# Altium project SyringeDriverHW10.PrjPcb
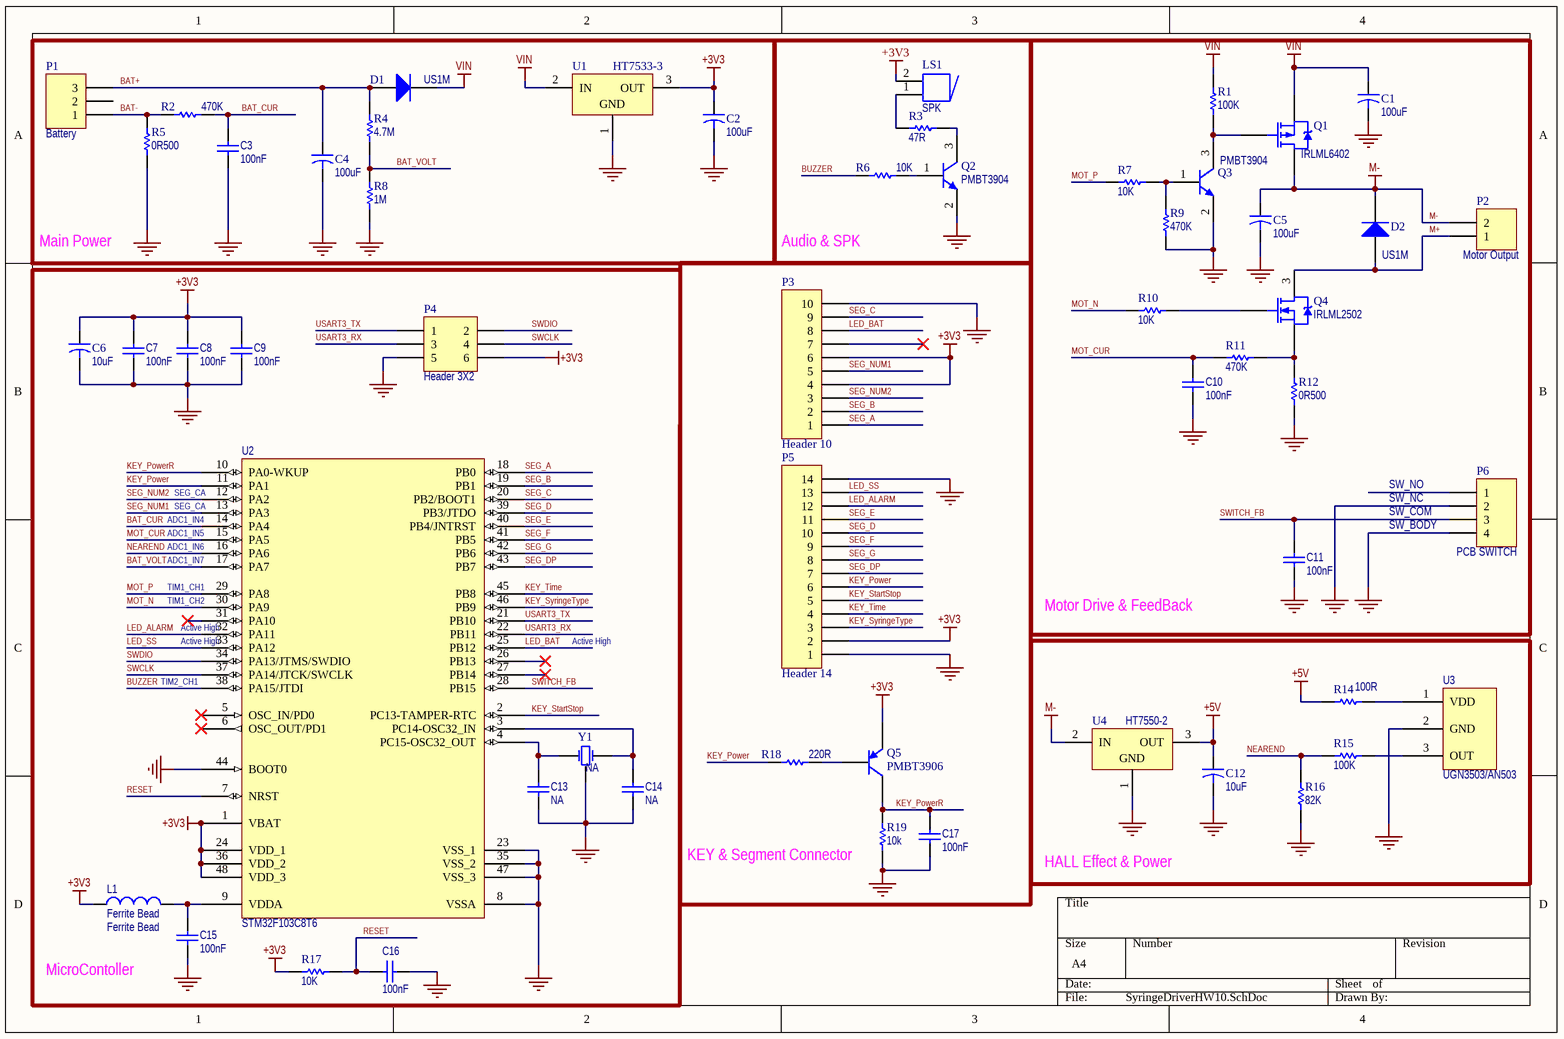
[diagram p0: SyringeDriverHW10.SchDoc]
1 sheet, 55 parts. Net scope: global (net labels, ports and power ports of the same name join across sheets).
Board file: SyringeDriverHW10.PcbDoc

## Sheet SyringeDriverHW10.SchDoc
size A4

### Parts
C1  100uF  [CAP_EL_SMD_6.3x5.4]
C2  100uF  [CAP_EL_SMD_6.3x5.4]
C3  100nF  [CAP0805]
C4  100uF  [CAP_EL_SMD_6.3x5.4]
C5  100uF  [CAP_EL_SMD_6.3x5.4]
C6  10uF  [CAP_TANTAL_TYPE_A]
C7  100nF  [CAP0805]
C8  100nF  [CAP0805]
C9  100nF  [CAP0805]
C10  100nF  [CAP0805]
C11  100nF  [CAP0805]
C12  10uF  [CAP_EL_SMD_4x5.3]
C13  NA  [CAP0805]
C14  NA  [CAP0805]
C15  100nF  [CAP0805]
C16  100nF  [CAP0805]
C17  100nF  [CAP0805]
D1  US1M  [DO-241AC]
D2  US1M  [DO-241AC]
L1  Ferrite Bead  [IND0805]
LS1  SPK  [XH-2PIN]
P1  Battery  [XH-3PIN]
P2  Motor Output  [XH-2PIN]
P3  Header 10  [HDR_1x10-2mm]
P4  Header 3X2  [HDR2X3]
P5  Header 14  [HDR_1x14-2mm]
P6  PCB SWITCH  [MICROSW_VERTICAL]
Q1  IRLML6402  [Micro3_N]
Q2  PMBT3904  [SOT23_N]
Q3  PMBT3904  [SOT23_N]
Q4  IRLML2502  [SOT-23_N]
Q5  PMBT3906  [SOT23_N]
R1  100K  [RES0805]
R2  470K  [RES0805]
R3  47R  [RES0805]
R4  4.7M  [RES0805]
R5  0R500  [RES2512]
R6  10K  [RES0805]
R7  10K  [RES0805]
R8  1M  [RES0805]
R9  470K  [RES0805]
R10  10K  [RES0805]
R11  470K  [RES0805]
R12  0R500  [RES2512]
R14  100R  [RES0805]
R15  100K  [RES0805]
R16  82K  [RES0805]
R17  10K  [RES0805]
R18  220R  [RES0805]
R19  10k  [RES0805]
U1  HT7533-3  [SOT89N]
U2  STM32F103C8T6  [LQFP48_N]
U3  UGN3503/AN503  [TO-92 BENT]
U4  HT7550-2  [SOT89N]
Y1  NA  [Crystal_NC308-RA]

### Nets
+3V3: C2.1 C6.1 C7.2 C8.2 C9.2 L1.1 LS1.2 P3.4 P3.6 P4.6 P5.2 Q5.2(E) R17.2 U1.3(OUT) U2.1(VBAT) U2.24(VDD_1) U2.36(VDD_2) U2.48(VDD_3)
+5V: C12.1 R14.1 U4.3(OUT)
GND: C1.2 C2.2 C3.1 C4.2 C5.2 C6.2 C7.1 C8.1 C9.1 C10.1 C11.1 C12.2 C13.1 C14.1 C15.1 C16.1 C17.2 P3.10 P4.5 P5.1 P5.14 P6.2 P6.4 Q2.2(E) Q3.2(E) R5.1 R8.2 R9.2 R12.1 R16.1 R19.1 U1.1(GND) U2.8(VSSA) U2.23(VSS_1) U2.35(VSS_2) U2.44(BOOT0) U2.47(VSS_3) U3.2(GND) U4.1(GND) Y1.3(GND)
M-: C5.1 D2.2(K) P2.2 Q1.3(D) U4.2(IN)
VIN: C1.1 D1.2(K) Q1.2(S) R1.1 U1.2(IN)
BAT+: C4.1 D1.1(A) P1.3 R4.1
BAT-: P1.1 R2.2 R5.2
BAT_CUR: C3.2 R2.1 U2.14(PA4)
BAT_VOLT: R4.2 R8.1 U2.17(PA7)
BUZZER: R6.2 U2.38(PA15/JTDI)
KEY_Power: P5.6 R18.1 U2.11(PA1)
KEY_PowerR: C17.1 Q5.3(C) R19.2 U2.10(PA0-WKUP)
KEY_StartStop: P5.5 U2.2(PC13-TAMPER-RTC)
KEY_SyringeType: P5.3 U2.46(PB9)
KEY_Time: P5.4 U2.45(PB8)
LED_ALARM: P5.12 U2.32(PA11)
LED_BAT: P3.8 U2.25(PB12)
LED_SS: P5.13 U2.33(PA12)
M+: D2.1(A) P2.1 Q4.3(D)
MOT_CUR: C10.2 R11.1 U2.15(PA5)
MOT_N: R10.1 U2.30(PA9)
MOT_P: R7.1 U2.29(PA8)
NEAREND: R15.1 R16.2 U2.16(PA6)
RESET: C16.2 R17.1 U2.7(NRST)
SEG_A: P3.1 U2.18(PB0)
SEG_B: P3.2 U2.19(PB1)
SEG_C: P3.9 U2.20(PB2/BOOT1)
SEG_D: P5.10 U2.39(PB3/JTDO)
SEG_DP: P5.7 U2.43(PB7)
SEG_E: P5.11 U2.40(PB4/JNTRST)
SEG_F: P5.9 U2.41(PB5)
SEG_G: P5.8 U2.42(PB6)
SEG_NUM1: P3.5 U2.13(PA3)
SEG_NUM2: P3.3 U2.12(PA2)
SWCLK: P4.4 U2.37(PA14/JTCK/SWCLK)
SWDIO: P4.2 U2.34(PA13/JTMS/SWDIO)
SWITCH_FB: C11.2 P6.3 U2.28(PB15)
USART3_RX: P4.3 U2.22(PB11)
USART3_TX: P4.1 U2.21(PB10)
NetC13_2: C13.2 U2.4(PC15-OSC32_OUT) Y1.1(OSC1)
NetC14_2: C14.2 U2.3(PC14-OSC32_IN) Y1.2(OSC2)
NetC15_2: C15.2 L1.2 U2.9(VDDA)
NetLS1_1: LS1.1 R3.1
NetQ1_1: Q1.1(G) Q3.3(C) R1.2
NetQ2_1: Q2.1(B) R6.1
NetQ2_3: Q2.3(C) R3.2
NetQ3_1: Q3.1(B) R7.2 R9.1
NetQ4_1: Q4.1(G) R10.2
NetQ4_2: Q4.2(S) R11.2 R12.2
NetQ5_1: Q5.1(B) R18.2
NetR14_2: R14.2 U3.1(VDD)
NetR15_2: R15.2 U3.3(OUT)

Not connected (* = marked no-connect by the designer): P1 2; P3 7*; P6 1; U2 5(OSC_IN/PD0)* 6(OSC_OUT/PD1)* 26(PB13)* 27(PB14)* 31(PA10)*

### Notes on the sheet
- Main Power
- Audio & SPK
- (near U2) ADC1_IN4
- (near U2) SEG_CA
- SW_NO
- SW_NC
- (near P6) SW_COM
- (near U2) ADC1_IN5
- (near U2) ADC1_IN6
- (near U2) ADC1_IN7
- (near P6) SW_BODY
- (near U2) TIM1_CH1
- (near U2) TIM1_CH2
- (near U2) Active High
- Active High
- Motor Drive & FeedBack
- (near U2) TIM2_CH1
- (near R19) KEY & Segment Connector
- HALL Effect & Power
- MicroContoller

### Library data of the parts
C1 C4 C5 = Cap2: Electrolyte 16V; Published: 23-Sep-2002; PackageReference: CAPR5-4X5; Publisher: Altium Limited; PackageDescription: Capacitor; 2 Leads; Value: 100uF
C2 = Cap2: Electrolyte  16V; Published: 23-Sep-2002; PackageReference: CAPR5-4X5; Publisher: Altium Limited; PackageDescription: Capacitor; 2 Leads; Value: 100uF
C3 C7-C11 C15-C17 = Cap: Capacitor; Published: 8-Jun-2000; LatestRevisionDate: 17-Jul-2002; LatestRevisionNote: Re-released for DXP Platform.; PackageReference: RAD-0.3; Publisher: Altium Limited; PackageDescription: Radial Cap, Thru-Hole; 2 Leads; 0.3 in Pin Spacing; Value: 100nF
C6 = Cap2: tantal 10V; Published: 23-Sep-2002; PackageReference: CAPR5-4X5; Publisher: Altium Limited; PackageDescription: Capacitor; 2 Leads; Value: 10uF
C12 = Cap2: Electrolyte 10V; Published: 23-Sep-2002; PackageReference: CAPR5-4X5; Publisher: Altium Limited; PackageDescription: Capacitor; 2 Leads; Value: 10uF
C13 C14 = Cap: Capacitor; Value: 10pF; Published: 8-Jun-2000; LatestRevisionDate: 17-Jul-2002; LatestRevisionNote: Re-released for DXP Platform.; PackageReference: RAD-0.3; Publisher: Altium Limited; PackageDescription: Radial Cap, Thru-Hole; 2 Leads; 0.3 in Pin Spacing
D1 D2 = Diode 1N4001: 1 Amp General Purpose Rectifier; Published: 8-Jun-2000; LatestRevisionDate: 17-Jul-2002; LatestRevisionNote: Re-released for DXP Platform.; DatasheetVersion: 1998; PackageVersion: Aug-1999; PackageReference: DO-41; Publisher: Altium Limited; PackageDescription: Diode, Axial; Body 5.2 x 2.7 mm (LxDia. max), Lead Dia. 0.86 mm (max); Code_JEDEC: DO-204-AL; ComponentLink1Description: Manufacturer Link; ComponentLink1URL: http://www.fairchildsemi.com/; ComponentLink2Description: Datasheet; ComponentLink2URL: http://www.fairchildsemi.com/ds/1N%2F1N4001.pdf
L1 = Inductor: Code_IEC: 1005; Published: 8-Jun-2000; LatestRevisionDate: 29-May-2009; LatestRevisionNote: IPC-7351 Footprint Added.; PackageReference: 0402-A; Publisher: Altium Limited; PackageDescription: Chip Inductor; Code_JEITA: 0402; Value: Ferrite Bead
LS1 = Buzzer: Magnetic Transducer Buzzer; Published: 24-Mar-1999; LatestRevisionDate: 17-Dec-2003; LatestRevisionNote: Schematic revised, PCB Footprint replaced.; DatasheetVersion: 17-Dec-2003; PackageReference: ABSM-1574; Publisher: Altium Limited; PackageDescription: Magnetic Transducer Buzzer; ComponentLink1Description: Manufacturer Link; ComponentLink1URL: http://www.megastar.com/linecard/buzzmode/index.php
P1 = Header 3: Header, 3-Pin; LatestRevisionDate: 17-Jul-2002; LatestRevisionNote: Re-released for DXP Platform.; Publisher: Altium Limited
P2 = Header 2: Header, 2-Pin; LatestRevisionDate: 17-Jul-2002; LatestRevisionNote: Re-released for DXP Platform.; Publisher: Altium Limited
P3 = Header 10: Header, 10-Pin; LatestRevisionDate: 17-Jul-2002; LatestRevisionNote: Re-released for DXP Platform.; Publisher: Altium Limited
P4 = Header 3X2: Header, 3-Pin, Dual row; LatestRevisionDate: 17-Jul-2002; LatestRevisionNote: Re-released for DXP Platform.; Publisher: Altium Limited
P5 = Header 14: Header, 14-Pin; LatestRevisionDate: 17-Jul-2002; LatestRevisionNote: Re-released for DXP Platform.; Publisher: Altium Limited
P6 = Header 4: Header, 4-Pin; LatestRevisionDate: 17-Jul-2002; LatestRevisionNote: Re-released for DXP Platform.; Publisher: Altium Limited
Q1 = IRLML6401: HEXFET Power MOSFET; Published: 17-Sep-2003; DatasheetVersion: 2-Jul-2001; PackageVersion: Jul-2001; PackageReference: Micro3; Publisher: Altium Limited; PackageDescription: 3-Pin SOT-23 Package 0.95 mm Pitch, 2.3 mm Lead Span; ComponentLink1Description: Manufacturer Link; ComponentLink1URL: http://www.irf.com/; ComponentLink2Description: Datasheet; ComponentLink2URL: http://www.irf.com/product-info/datasheets/data/IRLML6401.pdf
Q2 Q3 = PMBT3904: NPN Switching Transistor; Published: 17-Sep-2003; LatestRevisionDate: 12-Dec-2006; LatestRevisionNote: IPC-7351 Footprint Added.; DatasheetVersion: 27-Apr-1999; PackageVersion: May-1999; PackageReference: SOT23; Publisher: Altium Limited; PackageDescription: 3-Pin SOT-23 Package 0.95 mm Pitch, 2.3 mm Lead Span; ComponentLink1Description: Manufacturer Link; ComponentLink1URL: http://www.semiconductors.philips.com/; ComponentLink2Description: Datasheet; ComponentLink2URL: http://www.semiconductors.philips.com/acrobat/datasheets/PMBT3904_4.pdf
Q4 = IRLML2402: HEXFET Power MOSFET; Published: 8-Jun-2000; LatestRevisionDate: 20-Nov-2009; LatestRevisionNote: IPC-7351 Footprint Added.; DatasheetVersion: Aug-1997; PackageReference: SOT-23; Publisher: Altium Limited; PackageDescription: 3-Pin SOT-23 Package 0.95 mm Pitch, 2.3 mm Lead Span; ComponentLink1Description: Manufacturer Link; ComponentLink1URL: http://www.irf.com/; ComponentLink2Description: Datasheet; ComponentLink2URL: http://www.irf.com/product-info/datasheets/data/irlml2402.pdf
Q5 = PMBT3906: PNP Switching Transistor; Published: 17-Sep-2003; LatestRevisionDate: 12-Dec-2006; LatestRevisionNote: IPC-7351 Footprint Added.; DatasheetVersion: 27-Apr-1999; PackageVersion: May-1999; PackageReference: SOT23; Publisher: Altium Limited; PackageDescription: 3-Pin SOT-23 Package 0.95 mm Pitch, 2.3 mm Lead Span; ComponentLink1Description: Manufacturer Link; ComponentLink1URL: http://www.semiconductors.philips.com/; ComponentLink2Description: Datasheet; ComponentLink2URL: http://www.semiconductors.philips.com/acrobat/datasheets/PMBT3906_4.pdf
R1-R12 R14-R19 = Res1: Resistor; Published: 8-Jun-2000; LatestRevisionDate: 17-Jul-2002; LatestRevisionNote: Re-released for DXP Platform.; PackageReference: AXIAL-0.3; Publisher: Altium Limited; PackageDescription: Axial Device, Thru-Hole; 2 Leads; 0.3 in Pin Spacing
  R1 R15: Value: 100K
  R2 R9 R11: Value: 470K
  R3: Value: 47R
  R4: Value: 4.7M
  R5 R12: Value: 0R500
  R6 R7 R10 R17: Value: 10K
  R8: Value: 1M
  R14: Value: 100R
  R16: Value: 82K
  R18: Value: 220R
  R19: Value: 10k
U1 = HT7530-1: 3.0V 100mA Low Power,  Low Dropout Voltage (LDO) Regulator; Published: 30-Mar-2007; DatasheetVersion: rev1.50, Jan-2006; PackageVersion: Jan-2006; PackageReference: SOT-89; Publisher: Altium Limited; PackageDescription: 3-Pin SOT-89 Package 1.5 mm Pitch, 4.1 mm Lead Span; Code_IPC: SOT89; ComponentLink1Description: Manufacturer Link; ComponentLink1URL: http://www.holtek.com/; ComponentLink2Description: Datasheet; ComponentLink2URL: http://www.holtek.com/pdf/consumer/75xx_1v150.pdf
U2 = STM32F103C8T6: STM32 ARM-based 32-bit MCU with 64 Kbytes Flash, 48-pin LQFP, Industrial Temperature; Published: 30-May-2008; DatasheetVersion: rev6, Mar-2008; PackageVersion: Mar-2008; PackageReference: LQFP48; Publisher: Altium Limited; PackageDescription: 48-Pin Low-Profile Quad Flat Pack, 7 x 7 mm Body, 0.5 mm Pitch (LQFP48); ComponentLink1Description: Manufacturer Link; ComponentLink1URL: www.st.com/stm32; ComponentLink2Description: Datasheet; ComponentLink2URL: http://www.st.com/stonline/products/literature/ds/13587.pdf
U3 = UGN3503: RATIOMETRIC, LINEAR / HALL-EFFECT SENSORS
U4 = HT7530-1: 5.0V 100mA Low Power,  Low Dropout Voltage (LDO) Regulator; Published: 30-Mar-2007; DatasheetVersion: rev1.50, Jan-2006; PackageVersion: Jan-2006; PackageReference: SOT-89; Publisher: Altium Limited; PackageDescription: 3-Pin SOT-89 Package 1.5 mm Pitch, 4.1 mm Lead Span; Code_IPC: SOT89; ComponentLink1Description: Manufacturer Link; ComponentLink1URL: http://www.holtek.com/; ComponentLink2Description: Datasheet; ComponentLink2URL: http://www.holtek.com/pdf/consumer/75xx_1v150.pdf
Y1 = XTAL_Crystal_G: XTAL Crystal; Designer: ABBAS BASEREH; Value: 32.768kHz; Design Date: 2017-1-3; ComponentLink1Description: Datasheet; ComponentLink2Description: Reference; Mounting Technology: Surface Mount\Through-Hole; Status: Unreleased